# EAGLE schematic Kruispunt schema (EAGLE 9.2.2)
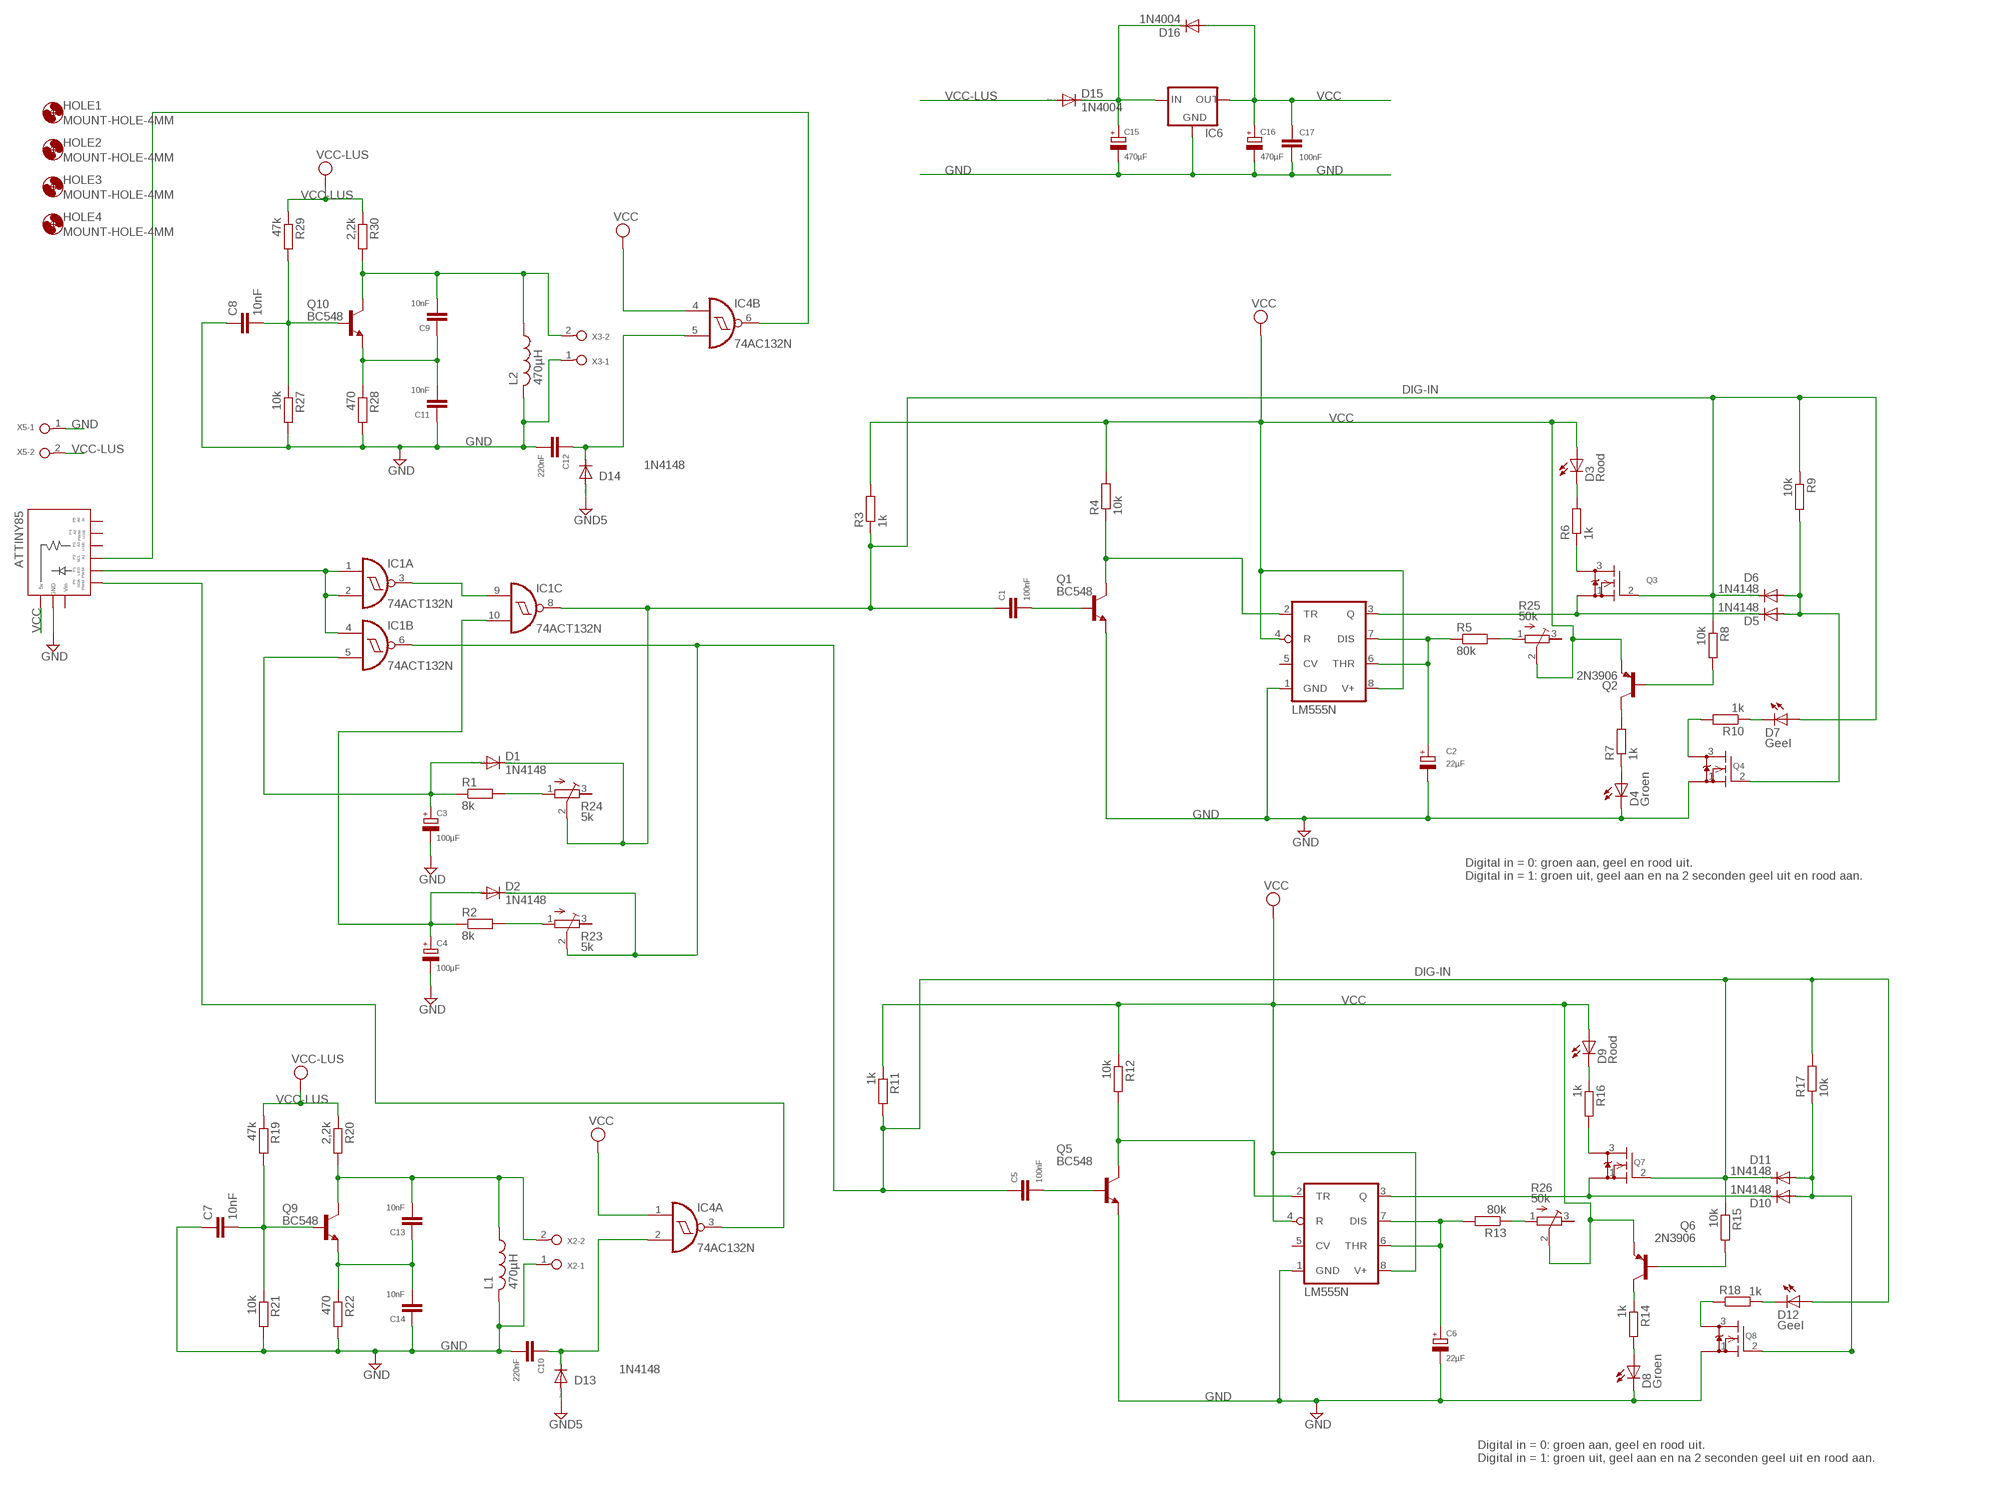
[diagram p0: schematic, sheet 1]

## Parts
ATTINY85  DIGISPARK  [DIGISPARK]
C1  100nF  CERAMIC-CAP3LEADS  [CERAMIC-CAP-C025_050-035X075]
C2  22µF  ELCOELCO2,5MMLEAD  [ELCO-2.5MMLEAD]
C3  100µF  ELCOELCO2,5MMLEAD  [ELCO-2.5MMLEAD]
C4  100µF  ELCOELCO2,5MMLEAD  [ELCO-2.5MMLEAD]
C5  100nF  CERAMIC-CAP3LEADS  [CERAMIC-CAP-C025_050-035X075]
C6  22µF  ELCOELCO2,5MMLEAD  [ELCO-2.5MMLEAD]
C7  10nF  CERAMIC-CAP3LEADS  [CERAMIC-CAP-C025_050-035X075]
C8  10nF  CERAMIC-CAP3LEADS  [CERAMIC-CAP-C025_050-035X075]
C9  10nF  CERAMIC-CAP3LEADS  [CERAMIC-CAP-C025_050-035X075]
C10  220nF  CERAMIC-CAP3LEADS  [CERAMIC-CAP-C025_050-035X075]
C11  10nF  CERAMIC-CAP3LEADS  [CERAMIC-CAP-C025_050-035X075]
C12  220nF  CERAMIC-CAP3LEADS  [CERAMIC-CAP-C025_050-035X075]
C13  10nF  CERAMIC-CAP3LEADS  [CERAMIC-CAP-C025_050-035X075]
C14  10nF  CERAMIC-CAP3LEADS  [CERAMIC-CAP-C025_050-035X075]
C15  470µF  ELCOELCO5,0MMLEAD  [ELCO-5,0MMLEAD]
C16  470µF  ELCOELCO5,0MMLEAD  [ELCO-5,0MMLEAD]
C17  100nF  CERAMIC-CAP3LEADS  [CERAMIC-CAP-C025_050-035X075]
D1  1N4148  1N4148DO35-7  [DO35-7]
D2  1N4148  1N4148DO35-7  [DO35-7]
D3  Rood  TLLY4400  [LED3MM]
D4  Groen  TLLY4400  [LED3MM]
D5  1N4148  1N4148DO35-7  [DO35-7]
D6  1N4148  1N4148DO35-7  [DO35-7]
D7  Geel  TLLY4400  [LED3MM]
D8  Groen  TLLY4400  [LED3MM]
D9  Rood  TLLY4400  [LED3MM]
D10  1N4148  1N4148DO35-7  [DO35-7]
D11  1N4148  1N4148DO35-7  [DO35-7]
D12  Geel  TLLY4400  [LED3MM]
D13  1N4148  1N4148DO35-7  [DO35-7]
D14  1N4148  1N4148DO35-7  [DO35-7]
D15  1N4004  1N4148DO35-7  [DO35-7]
D16  1N4004  1N4148DO35-7  [DO35-7]
HOLE1  MOUNT-HOLE-4MM  [4,0]
HOLE2  MOUNT-HOLE-4MM  [4,0]
HOLE3  MOUNT-HOLE-4MM  [4,0]
HOLE4  MOUNT-HOLE-4MM  [4,0]
IC1  74ACT132N  [DIL14]
IC2  LM555N  [DIL08]
IC3  LM555N  [DIL08]
IC4  74AC132N  [DIL14]
IC6  LM78XX-TO220LM78XX-HEATSINK  [LM78XX-HEATSINK]
L1  470µH  SPOEL  [IR-4]
L2  470µH  SPOEL  [IR-4]
Q1  BC548  [TO92-CBE]
Q2  2N3906  [TO92-EBC]
Q3  2N7000  [TO-92]
Q4  2N7000  [TO-92]
Q5  BC548  [TO92-CBE]
Q6  2N3906  [TO92-EBC]
Q7  2N7000  [TO-92]
Q8  2N7000  [TO-92]
Q9  BC548  [TO92-CBE]
Q10  BC548  [TO92-CBE]
R1  8k  RESISTOR  [0207/10]
R2  8k  RESISTOR  [0207/10]
R3  1k  RESISTOR  [0207/10]
R4  10k  RESISTOR  [0207/10]
R5  80k  RESISTOR  [0207/10]
R6  1k  RESISTOR  [0207/10]
R7  1k  RESISTOR  [0207/10]
R8  10k  RESISTOR  [0207/10]
R9  10k  RESISTOR  [0207/10]
R10  1k  RESISTOR  [0207/10]
R11  1k  RESISTOR  [0207/10]
R12  10k  RESISTOR  [0207/10]
R13  80k  RESISTOR  [0207/10]
R14  1k  RESISTOR  [0207/10]
R15  10k  RESISTOR  [0207/10]
R16  1k  RESISTOR  [0207/10]
R17  10k  RESISTOR  [0207/10]
R18  1k  RESISTOR  [0207/10]
R19  47k  RESISTOR  [0207/10]
R20  2,2k  RESISTOR  [0207/10]
R21  10k  RESISTOR  [0207/10]
R22  470  RESISTOR  [0207/10]
R23  5k  R-TRIMM64W  [RTRIM64W]
R24  5k  R-TRIMM64W  [RTRIM64W]
R25  50k  R-TRIMM64W  [RTRIM64W]
R26  50k  R-TRIMM64W  [RTRIM64W]
R27  10k  RESISTOR  [0207/10]
R28  470  RESISTOR  [0207/10]
R29  47k  RESISTOR  [0207/10]
R30  2,2k  RESISTOR  [0207/10]
X2  TERMINAL-5MM-2POLE  [W237-132]
X3  TERMINAL-5MM-2POLE  [W237-132]
X5  TERMINAL-5MM-2POLE  [W237-132]

## Nets
DIG-IN: C1.P$2 C1.P$3 C5.P$2 C5.P$3 D2.C D6.C D7.A D11.C D12.A IC1.6(B:O) Q3.2(G) Q7.2(G) R3.1 R8.1 R9.1 R11.2 R15.1 R17.2 R23.2(S)
GND [VCC]: ATTINY85.GND ATTINY85.GND1(GND) C2.- C3.- C4.- C6.- C7.P$2 C7.P$3 C8.P$2 C8.P$3 C10.P$1 C11.P$2 C11.P$3 C12.P$1 C14.P$2 C14.P$3 C15.- C16.- C17.P$1 D4.K(C) D8.K(C) IC2.1(GND) IC3.1(GND) IC6.GND L1.2 L2.2 Q1.E Q4.1(S) Q5.E Q8.1(S) R21.2 R22.2 R27.2 R28.2 X2.1 X3.1 X5.1
GND5: D13.A D14.A
N$1: ATTINY85.P1 IC1.1(A:I0) IC1.2(A:I1) IC1.4(B:I0)
N$2: IC1.3(A:O) IC1.9(C:I0)
N$3: C3.+ D1.A IC1.5(B:I1) R1.1
N$4: C1.P$1 Q1.B
N$5: R13.1 R26.1(A)
N$6: R2.2 R23.1(A)
N$7: C4.+ D2.A IC1.10(C:I1) R2.1
N$8: IC2.2(TR) Q1.C R4.1
N$9: C2.+ IC2.6(THR) IC2.7(DIS) R5.1
N$10: Q2.C R7.2
N$11: D4.A R7.1
N$12: Q2.B R8.2
N$13: Q3.3(D) R6.1
N$14: D3.K(C) R6.2
N$15: D5.C IC2.3(Q) Q3.1(S)
N$16: D5.A D6.A Q4.2(G) R9.2
N$17: Q4.3(D) R10.2
N$18: D7.K(C) R10.1
N$19: C5.P$1 Q5.B
N$20: IC3.2(TR) Q5.C R12.2
N$21: C6.+ IC3.6(THR) IC3.7(DIS) R13.2
N$22: Q6.C R14.1
N$23: D8.A R14.2
N$24: Q6.B R15.2
N$25: Q7.3(D) R16.2
N$26: D9.K(C) R16.1
N$27: D10.C IC3.3(Q) Q7.1(S)
N$28: D10.A D11.A Q8.2(G) R17.1
N$29: Q8.3(D) R18.1
N$30: D12.K(C) R18.2
N$31: C7.P$1 Q9.B R19.2 R21.1
N$32: C13.P$2 C13.P$3 C14.P$1 Q9.E R22.1
N$33: C13.P$1 L1.1 Q9.C R20.2 X2.2
N$34: C10.P$2 C10.P$3 D13.C IC4.2(A:I1)
N$35: ATTINY85.P0 IC4.3(A:O)
N$36: R1.2 R24.1(A)
N$37: R5.2 R25.1(A)
N$38: D1.C IC1.8(C:O) R24.2(S)
N$39: C8.P$1 Q10.B R27.1 R29.2
N$40: C9.P$2 C9.P$3 C11.P$1 Q10.E R28.1
N$41: C9.P$1 L2.1 Q10.C R30.2 X3.2
N$42: C12.P$2 C12.P$3 D14.C IC4.5(B:I1)
N$44: ATTINY85.P2 IC4.6(B:O)
N$45: C15.+ D15.C D16.C IC6.IN
VCC [VCC]: ATTINY85.5V ATTINY85.5V1(5V) C16.+ C17.P$2 C17.P$3 D3.A D9.A D16.A IC2.4(R) IC2.8(V+) IC3.4(R) IC3.8(V+) IC4.1(A:I0) IC4.4(B:I0) IC6.OUT Q2.E Q6.E R3.2 R4.2 R11.1 R12.1 R25.2(S) R26.2(S)
VCC-LUS [VCC]: D15.A R19.1 R20.1 R29.1 R30.1 X5.2
Unconnected: ATTINY85.P3 ATTINY85.P4 ATTINY85.P5 IC1.11(D:O) IC1.12(D:I0) IC1.13(D:I1) IC2.5(CV) IC3.5(CV) IC4.8(C:O) IC4.9(C:I0) IC4.10(C:I1) IC4.11(D:O) IC4.12(D:I0) IC4.13(D:I1) R23.3(E) R24.3(E) R25.3(E) R26.3(E)

## Notes on the sheet
- Digital in = 0: groen aan, geel en rood uit.
  Digital in = 1: groen uit, geel aan en na 2 seconden geel uit en rood aan.
- Digital in = 0: groen aan, geel en rood uit.
  Digital in = 1: groen uit, geel aan en na 2 seconden geel uit en rood aan.

## Power pins joined to a net without a drawn wire
GND: IC1.7(P:GND) IC4.7(P:GND)
VCC: IC1.14(P:VCC) IC4.14(P:VCC)
VIN: ATTINY85.VIN ATTINY85.VIN1(VIN)

## Library data of the parts
ATTINY85 = Kruispunt Library:DIGISPARK: Digispark http://digistump.com/wiki/digispark
C1 C5 C7-C14 C17 = Kruispunt Library:CERAMIC-CAP: ceramic capacitor leads 2.5mm and 5.5mm
C2-C4 C6 C15 C16 = Kruispunt Library:ELCO: electrolytic capacitor 2.5mm or 3.5mm lead or SMD
D1 D2 D5 D6 D10 D11 D13-D16 = Kruispunt Library:1N4148: DIODE high speed (Philips)
D3 D4 D7-D9 D12 = Hardware lichtsturing library:TLLY4400: Low Current (2mA) LED 3 mm Tinted Diffused Package color YELLOW Source: Data sheet <http://www.farnell.com/datasheets/391098.pdf>; MF: VISHAY SEMICONDUCTOR; OC_FARNELL: 1612439
HOLE1-HOLE4 = Kruispunt Library:MOUNT-HOLE-4MM
IC1 IC4 = Kruispunt Library:74*132: Quad 2-input NAND schmitt trigger
IC2 IC3 = Kruispunt Library:*555: TIMER
IC6 = Kruispunt Library:LM78XX-TO220: LM78xx TO220 VOLTAGE REGULATOR
L1 L2 = Detectielus library:SPOEL
Q1 Q5 Q9 Q10 = Kruispunt Library:BC548*: NPN Transistor
Q2 Q6 = Kruispunt Library:2N3906: PNP Transistor
Q3 Q4 Q7 Q8 = Kruispunt Library:2N7000: Silicon N-Channel MOS FET 0.35A TTL-logic
R1-R22 R27-R30 = Kruispunt Library:RESISTOR
R23-R26 = Kruispunt Library:R-TRIMM: Trimm resistor
X2 X3 X5 = Kruispunt Library:TERMINAL-5MM-2POLE: WAGO SCREW CLAMP; OC_FARNELL: unknown; OC_NEWARK: unknown

## Net classes
1 VCC: width 1.016 mm